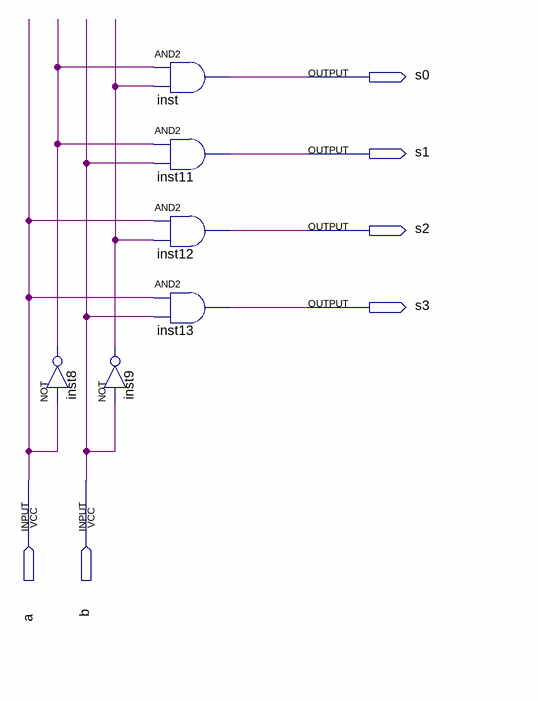
[diagram p0: schematic sheet]
// Quartus schematic Decoder2_4.bdf as structural Verilog: 6 symbols, 6 pins
module Decoder2_4 (
  input  a,
  input  b,
  output s0,
  output s1,
  output s2,
  output s3
);

  wire inst8_out, inst9_out;

  not inst8 (inst8_out, a);
  not inst9 (inst9_out, b);
  and inst (s0, inst8_out, inst9_out);
  and inst11 (s1, inst8_out, b);
  and inst12 (s2, a, inst9_out);
  and inst13 (s3, a, b);
endmodule
